# EAGLE design NorthPaw_V1p5 (EAGLE 5.05)
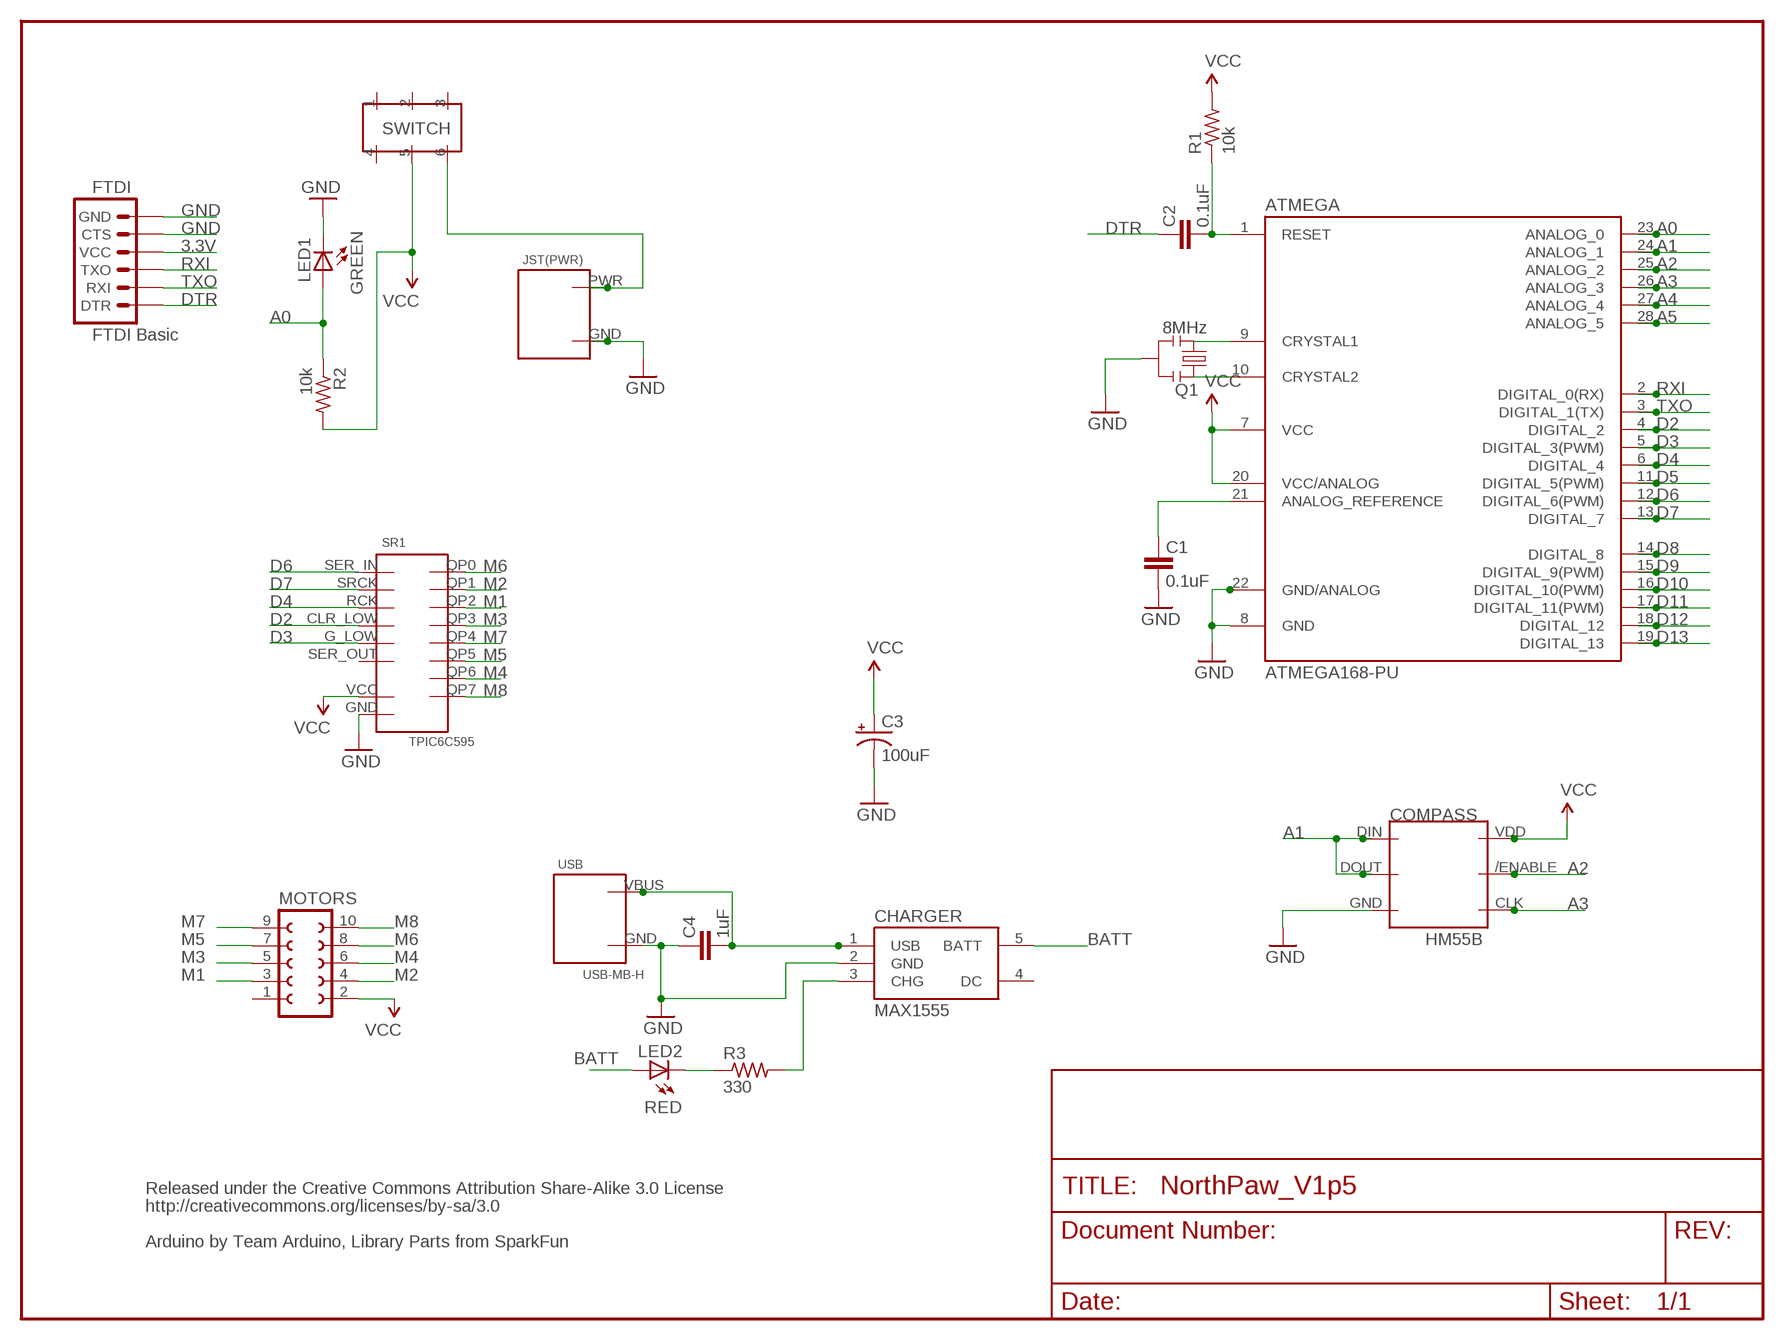
[diagram p0: schematic, sheet 1]

## Parts
ATMEGA  ATMEGA168-PU  [DIL28-3]
C1  0.1uF  CAPPTH  [CAP-PTH-SMALL]
C2  0.1uF  CAPPTH  [CAP-PTH-SMALL]
C3  100uF  CAP_POLPTH1  [CPOL-RADIAL-100UF-25V]
C4  1uF  CAPPTH  [CAP-PTH-SMALL]
CHARGER  MAX1555  [SOT23-5]
COMPASS  HM55B  [HM55B]
FTDI  FTDI Basic  ARDUINO_SERIAL_PROGRAMPTH  [1X06]
JST(PWR)  S2B-PH-K-S  [S4B-ZR]
LED1  GREEN  LED3MM  [LED3MM]
LED2  RED  LED3MM  [LED3MM]
MOTORS  FE05-2  [FE05-2]
Q1  8MHz  RESONATORPTH  [RESONATOR-PTH]
R1  10k  R-US_0204/7  [0204/7]
R2  10k  R-US_0204/7  [0204/7]
R3  330  R-US_0204/7  [0204/7]
SR1  TPIC6C595  [TPIC6C595]
SWITCH  OS202011MA0QS1  [OS202011MA0QS1]
USB  USB-MB-H  [USB-MB-H]

## Nets
3.3V [ground]: ATMEGA.7(VCC) ATMEGA.20(VCC/ANALOG) C3.1(+) COMPASS.VDD FTDI.4(VCC) MOTORS.2 R1.2 R2.2 SR1.VCC SWITCH.5 ; supply symbol labelled VCC
A0: ATMEGA.23(ANALOG_0) LED1.A R2.1
A1: ATMEGA.24(ANALOG_1) COMPASS.DIN(IN) COMPASS.DOUT(OUT)
A2: ATMEGA.25(ANALOG_2) COMPASS./ENABLE(ENABLE)
A3: ATMEGA.26(ANALOG_3) COMPASS.CLK
A4: ATMEGA.27(ANALOG_4)
A5: ATMEGA.28(ANALOG_5)
BATT [power]: CHARGER.5(BATT) JST(PWR).PWR LED2.A SWITCH.6
D2: ATMEGA.4(DIGITAL_2) SR1.CLR_LOW
D3: ATMEGA.5(DIGITAL_3(PWM)) SR1.G_LOW
D4: ATMEGA.6(DIGITAL_4) SR1.RCK
D5: ATMEGA.11(DIGITAL_5(PWM))
D6: ATMEGA.12(DIGITAL_6(PWM)) SR1.SER_IN
D7: ATMEGA.13(DIGITAL_7) SR1.SRCK
D8: ATMEGA.14(DIGITAL_8)
D9: ATMEGA.15(DIGITAL_9(PWM))
D10: ATMEGA.16(DIGITAL_10(PWM))
D11: ATMEGA.17(DIGITAL_11(PWM))
D12: ATMEGA.18(DIGITAL_12)
D13: ATMEGA.19(DIGITAL_13)
DTR: C2.2 FTDI.1(DTR)
GND [ground]: ATMEGA.8(GND) ATMEGA.22(GND/ANALOG) C1.1 C3.2(-) C4.2 CHARGER.2(GND) FTDI.5(CTS) FTDI.6(GND) JST(PWR).GND LED1.K(C) Q1.2 SR1.GND USB.GND
M1: MOTORS.3 SR1.QP2
M2: MOTORS.4 SR1.QP1
M3: MOTORS.5 SR1.QP3
M4: MOTORS.6 SR1.QP6
M5: MOTORS.7 SR1.QP5
M6: MOTORS.8 SR1.QP0
M7: MOTORS.9 SR1.QP4
M8: MOTORS.10 SR1.QP7
N$1: ATMEGA.9(CRYSTAL1) Q1.3
N$2: ATMEGA.10(CRYSTAL2) Q1.1
N$3: ATMEGA.21(ANALOG_REFERENCE) C1.2
N$7: CHARGER.3(CHG) R3.2
N$9: LED2.K(C) R3.1
RESET: ATMEGA.1(RESET) C2.1 R1.1
RXI: ATMEGA.2(DIGITAL_0(RX)) FTDI.3(TXO)
TXO: ATMEGA.3(DIGITAL_1(TX)) FTDI.2(RXI)
USB_VIN: C4.1 CHARGER.1(USB) USB.VBUS(PWR)
Unconnected: CHARGER.4(DC) MOTORS.1 SR1.SER_OUT

## Notes on the sheet
- SWITCH
- Released under the Creative Commons Attribution Share-Alike 3.0 License
- http://creativecommons.org/licenses/by-sa/3.0
- Arduino by Team Arduino, Library Parts from SparkFun

## Power pins joined to a net without a drawn wire
1: SWITCH.1
2: SWITCH.2
3: SWITCH.3
4: SWITCH.4
GND: COMPASS.GND

## Library data of the parts
ATMEGA = Arduino-AVR:ATMEGA168-PU
C1 C2 C4 = SparkFun:CAP: Capacitor Standard 0603 ceramic capacitor, and 0.1" leaded capacitor.
C3 = SparkFun:CAP_POL: Capacitor Polarized These are standard SMD and PTH capacitors. Normally 10uF, 47uF, and 100uF in electrolytic and tantalum varieties. Always verify the external diameter of the through hole cap, it varies with capacity, voltage, and manufacturer. The EIA devices should be standard.
CHARGER = SparkFun:MAX1555: MAX1555 Lithium Charger IC SOT-23 Lithium Polymer charging IC. Schematic element and footprint proven. Spark Fun Electronics SKU : COM-00674
COMPASS = North_Paw:HM55B
FTDI = SparkFun:ARDUINO_SERIAL_PROGRAM
JST(PWR) = North_Paw:S2B-PH-K-S
LED1 LED2 = SparkFun:LED: LEDs Standard schematic elements and footprints for 5mm, 3mm, 1206, and 0603 sized LEDs. 5mm - Spark Fun Electronics SKU : COM-00529 (and others)
MOTORS = North_Paw:FE05-2: FEMALE HEADER
Q1 = SparkFun:RESONATOR: Resonator Small SMD resonator. This is the itty bitty 10/20MHz resonators with built in caps. CSTCE10M0G55 and CSTCE20M0V53. Footprint has been reviewed closely but hasn't been tested yet.
R1-R3 = resistor:R-US_: RESISTOR, American symbol
SR1 = North_Paw:TPIC6C595
SWITCH = OS202011MA0QS1:OS202011MA0QS1
USB = North_Paw:USB-MB-H

## Net classes
0 default: width 0.381 mm, clearance 0.381 mm
1 power: width 0.508 mm, clearance 0.381 mm
2 ground: width 0.508 mm, clearance 0.381 mm

## Board
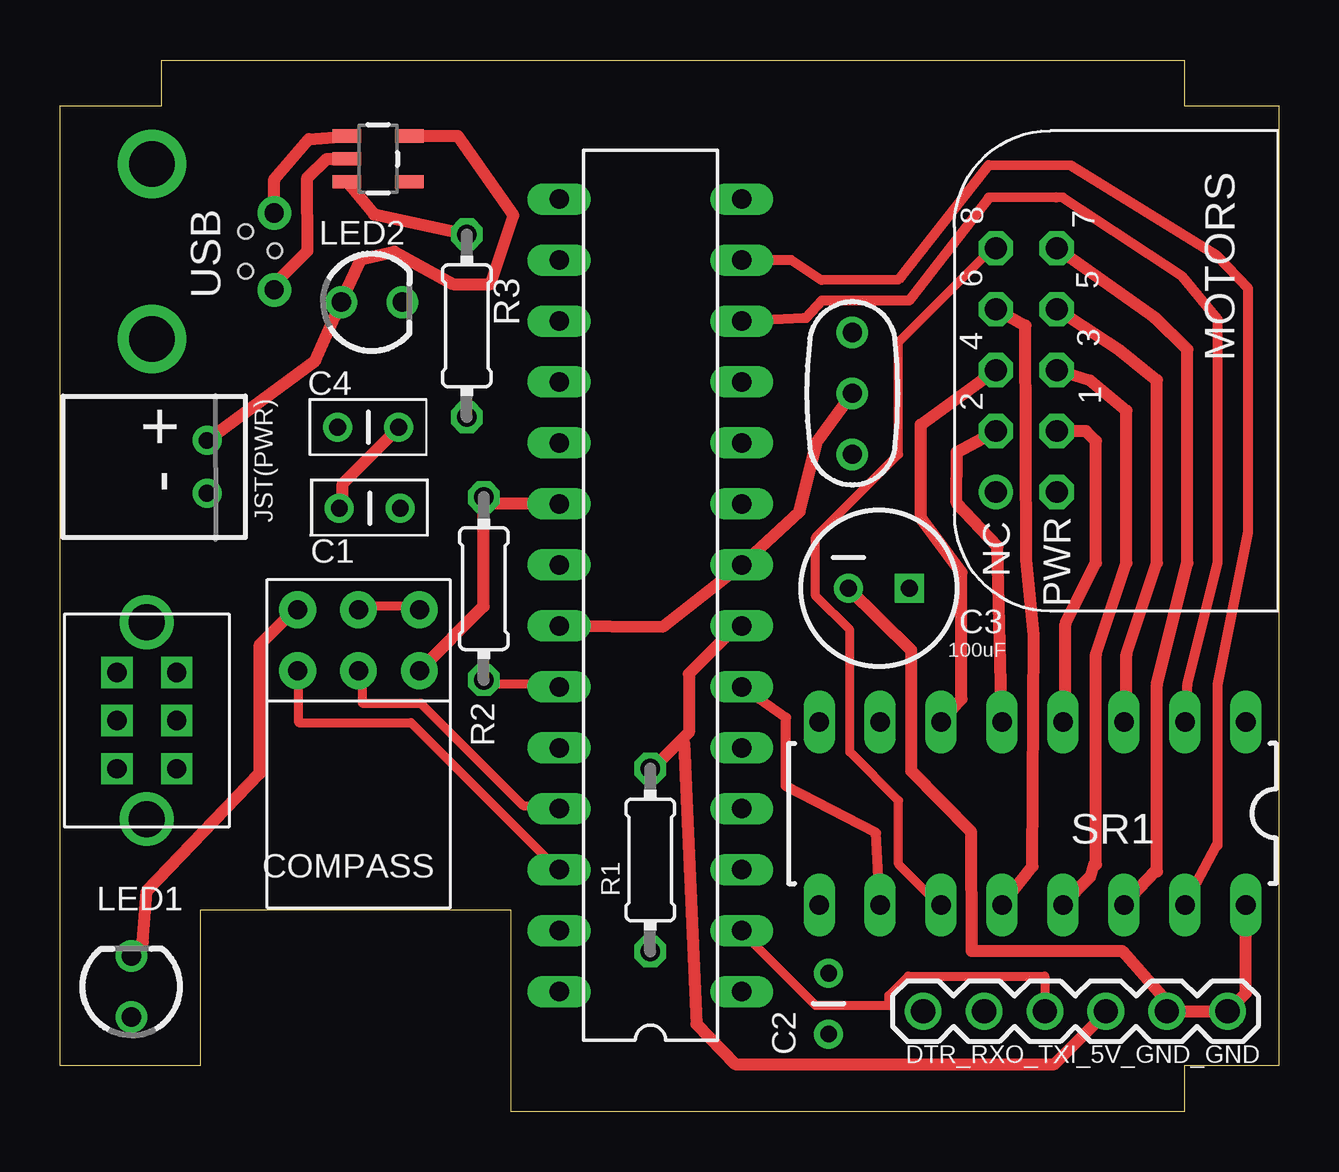
[diagram p1: board, top side]
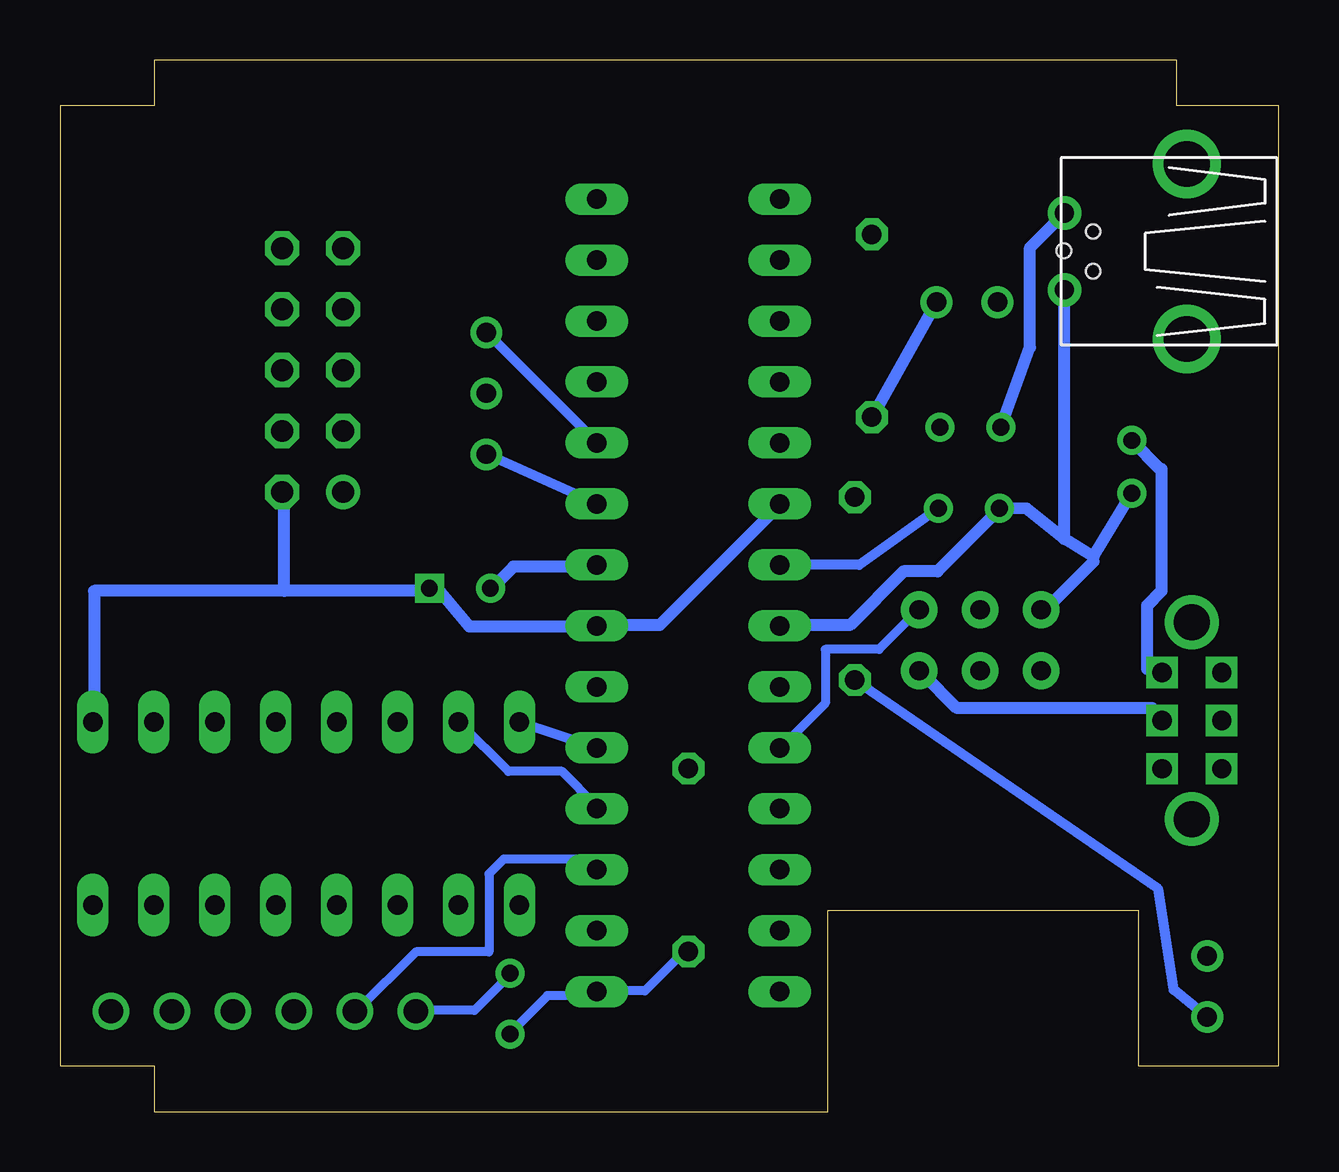
[diagram p2: board, bottom side, seen from below]

Size 50.8 x 43.81 mm. Coordinates in mm from the lower left corner, seen from the top.
Outline: 0,1.9 0,41.91 4.24,41.91 4.24,43.81 46.86,43.81 46.86,41.91 50.8,41.91 50.8,1.9 46.86,1.9 46.86,0 18.8,0 18.8,8.38 5.84,8.38 5.84,1.9 0,1.9
Copper layers (1*16): Top 0.035mm / dielectric 1.5mm / Bottom 0.035mm
Design rules "default *": minimum track width 8mil, minimum drill 24mil, track to track 8mil, track to pad 6mil, pad to pad 6mil, via to via 6mil, smd to smd 6mil, copper to edge 40mil, drill to drill 8mil, minimum pad ring 10mil, minimum via ring 8mil, stop-mask expansion 4mil, vias tented up to drill 0mil, thermal gap 10mil

### Footprints (pad centres in the part's own frame; a part is rotated, then mirrored left to right if it is on the bottom)
DIL28-3 = drill 0.813 long: 1 -16.51,-3.81; 2 -13.97,-3.81; 3 -11.43,-3.81; 4 -8.89,-3.81; 5 -6.35,-3.81; 6 -3.81,-3.81; 7 -1.27,-3.81; 8 1.27,-3.81; 9 3.81,-3.81; 10 6.35,-3.81; 11 8.89,-3.81; 12 11.43,-3.81; 13 13.97,-3.81; 14 16.51,-3.81; 15 16.51,3.81; 16 13.97,3.81; 17 11.43,3.81; 18 8.89,3.81; 19 6.35,3.81; 20 3.81,3.81; 21 1.27,3.81; 22 -1.27,3.81; 23 -3.81,3.81; 24 -6.35,3.81; 25 -8.89,3.81; 26 -11.43,3.81; 27 -13.97,3.81; 28 -16.51,3.81
CAP-PTH-SMALL = drill 0.7 round: 1 0,0; 2 2.54,0
CPOL-RADIAL-100UF-25V = drill 0.7 square: 1 1.27,0 | drill 0.7 round: 2 -1.27,0
SOT23-5 = smd 0.55 x 1.2: 1 -0.95,-1.3; 2 0,-1.3; 3 0.95,-1.3; 4 0.95,1.3; 5 -0.95,1.3
HM55B = drill 0.8 pad 1.524 round: /ENABLE 0,0; CLK 2.54,0; DIN -2.54,-2.54; DOUT 0,-2.54; GND 2.54,-2.54; VDD -2.54,0
1X06 = drill 1.016 round: 1 0,0; 2 2.54,0; 3 5.08,0; 4 7.62,0; 5 10.16,0; 6 12.7,0
S4B-ZR = drill 0.7 pad 1.15 round: GND 1.1,0; PWR -1.1,0
LED3MM = drill 0.813 round: A -1.27,0; K 1.27,0
FE05-2 = drill 0.914 round: 1 5.05,-6.27 | drill 0.914 octagon: 2 5.05,-3.73; 3 2.51,-6.27; 4 2.51,-3.73; 5 -0.03,-6.27; 6 -0.03,-3.73; 7 -2.57,-6.27; 8 -2.57,-3.73; 9 -5.11,-6.27; 10 -5.11,-3.73
RESONATOR-PTH = drill 0.8 round: 1 -2.54,0; 2 0,0; 3 2.54,0
0204/7 = drill 0.813 octagon: 1 -3.81,0; 2 3.81,0
TPIC6C595 = drill 0.813 long: CLR_LOW -3.81,-6.35; G_LOW -3.81,-8.89; GND 3.81,8.89; QP0 -3.81,3.81; QP1 -3.81,1.27; QP2 -3.81,-1.27; QP3 -3.81,-3.81; QP4 3.81,-3.81; QP5 3.81,-1.27; QP6 3.81,1.27; QP7 3.81,3.81; RCK 3.81,-6.35; SER_IN -3.81,6.35; SER_OUT 3.81,-8.89; SRCK 3.81,6.35; VCC -3.81,8.89
OS202011MA0QS1 = drill 0.8 pad 1.016 square: 1 -2.007,1.245; 2 0,1.245; 3 2.007,1.245; 4 -2.007,-1.245; 5 0,-1.245; 6 2.007,-1.245 | drill 1.499 pad 2.032 round: P$1 4.102,0; P$2 -4.102,0
USB-MB-H = drill 0.8 pad 1.397 round: GND 5.1,-1.6; VBUS 5.1,1.6 | drill 1.9 round: P$6 0,-3.65; P$7 0,3.65 | hole 0.6: 3.911,0.829; 5.13,0.023; 3.911,-0.829

### Placement (x,y rotation side)
ATMEGA  24.61,21.51 90 top
C1  11.64,25.13 0 top
C2  32.04,3.23 90 top
C3  34.13,21.81 0 top
C4  11.58,28.51 0 top
CHARGER  13.26,39.7 270 top
COMPASS  12.45,18.37 180 top
FTDI  35.97,4.18 0 top
JST(PWR)  6.13,26.86 270 top
LED1  2.98,5.21 90 top
LED2  13,33.72 0 top
MOTORS  45.27,30.87 270 top
Q1  33.03,29.93 270 top
R1  24.6,10.48 90 top
R2  17.67,21.79 90 top
R3  16.96,32.74 90 top
SR1  40.54,12.42 270 top
SWITCH  3.62,16.29 90 top
USB  3.83,35.84 0 top

### Tracks (layer width: path | path; a pad name or v marks a point on that pad's centre or on a via)
3.3V
  Top 0.508: 25.91,15.49 26.21,15.8 26.21,18.24 28.25,20.27 ATMEGA.7 | 25.91,15.49 24.79,14.38 R1.2 | FTDI.4 43.48,4.01 41.45,1.98 28.14,1.98 26.53,3.64 26.01,15.39 25.91,15.49 | COMPASS.VDD 17.67,21.05 R2.2 17.68,25.35 20.73,25.35 ATMEGA.20
  Bottom 0.508: SWITCH.5 4.88,16.41 5.28,16.82 13.41,16.82 14.83,18.24 COMPASS.VDD | ATMEGA.20 20.93,25.15 25.81,20.27 28.25,20.27 ATMEGA.7 28.65,20.27 28.85,20.2 33.73,20.2 35.15,21.89 C3.1 | C3.1 35.56,21.89 | 41.45,21.69 35.56,21.69 C3.1 | 41.45,21.69 49.38,21.69 49.38,16.41 SR1.VCC | MOTORS.2 41.45,25.76 41.45,21.69
A0
  Top 0.381: ATMEGA.23 20.73,17.83 17.68,17.83 R2.1
  Bottom 0.406: LED1.A 4.37,5.07 5.02,9.28 R2.1
A1
  Top 0.381: COMPASS.DOUT 12.6,21.08 14.83,21.08 COMPASS.DIN
  Bottom 0.381: ATMEGA.24 20.73,15.19 18.9,17.02 18.9,19.25 16.66,19.25 15.04,20.88 COMPASS.DIN
A2
  Top 0.381: ATMEGA.25 20.73,12.75 19.3,12.75 15.04,17.02 12.6,17.02 12.6,18.24 COMPASS./ENABLE
A3
  Top 0.381: ATMEGA.26 20.73,10.11 14.63,16.21 9.96,16.21 9.96,18.24 COMPASS.CLK
BATT
  Top 0.508: CHARGER.5 16.59,40.65 18.91,37.34 17.95,34.47 16.38,34.47 13.94,35.83 12.56,35.51 LED2.A 10.64,31.29 JST(PWR).PWR
  Bottom 0.508: SWITCH.6 4.88,18.44 5.49,18.44 5.49,21.08 4.88,21.69 4.88,26.77 4.93,26.77 JST(PWR).PWR
D2
  Bottom 0.381: ATMEGA.4 28.45,12.75 29.87,14.17 32.11,14.17 34.14,16.21 SR1.CLR_LOW
D3
  Bottom 0.406: ATMEGA.5 SR1.G_LOW
D4
  Top 0.406: SR1.RCK 34.02,11.61 30.26,13.56 30.26,16.42 ATMEGA.6
D6
  Top 0.406: SR1.SER_IN 46.99,16.23 46.99,17.78 48.26,22.86 48.26,33.02 46.77,34.8 41.8,38.08 41.51,38.09 38.72,38.08 35.39,33.79 31.75,33.79 31.1,33.06 31,33.06 ATMEGA.12
D7
  Top 0.406: SR1.SRCK 48.19,11.08 48.26,11.08 48.26,17.78 49.53,24.13 49.53,34.29 48.21,35.67 42.14,39.41 38.7,39.44 34.94,34.66 31.74,34.64 30.48,35.48 ATMEGA.13
DTR
  Bottom 0.381: C2.2 32.11,5.64 33.53,4.22 35.97,4.22 FTDI.1
GND
  Top 0.508: CHARGER.2 11.12,39.7 10.31,38.92 10.31,35.86 8.93,34.48 USB.GND | Q1.2 31.55,27.9 30.83,25 ATMEGA.8 25.13,20.21 ATMEGA.22 20.52,20.27 | 14.22,28.6 C4.2 14.02,28.4 11.79,26.16 11.79,25.15 C1.1 | LED1.K 3.05,6.65 3.45,7.06 3.62,9.18 8.33,14.09 8.33,19.46 9.75,20.88 COMPASS.GND | C3.2 35.48,19.24 35.48,14.19 37.98,11.65 38,6.69 44.27,6.69 46.41,4.29 | 46.41,4.29 46.51,4.18 FTDI.6 49.43,4.93 SR1.GND | FTDI.5 46.33,4.22 46.41,4.29
  Bottom 0.508: 8.94,23.87 10.5,25.13 C1.1 11.79,24.94 14.22,22.5 15.65,22.5 17.88,20.27 20.73,20.27 ATMEGA.22 | 7.72,23.11 8.94,23.87 | 7.72,23.11 7.72,22.91 9.55,21.08 9.75,21.08 COMPASS.GND | C3.2 32.72,21.89 31.9,22.71 28.45,22.71 ATMEGA.8 | 8.94,23.87 8.94,34.23 USB.GND | 7.72,23.11 JST(PWR).GND
M1
  Top 0.508: SR1.QP2 39.08,23.55 37.37,25.38 37.38,27.48 MOTORS.3
M2
  Top 0.406: SR1.QP1 41.91,16.33
  Top 0.508: MOTORS.4 42.76,28.36 43.18,27.94 43.18,22.86 41.91,20.32 41.91,16.33
  Bottom 0.381: SR1.QP1 41.66,16.41
M3
  Top 0.508: SR1.QP3 37.58,17.19 37.58,22.46 35.88,24.74 35.88,28.62 MOTORS.5
M4
  Top 0.508: SR1.QP6 42.94,9.78 43.11,10.3 43.18,10.3 43.18,19.05 44.45,22.86 44.45,29.21 42.94,30.46 MOTORS.6
M5
  Top 0.508: SR1.QP5 40.54,10.21 40.59,19.85 40.28,22.98 40.25,32.74 MOTORS.7
M6
  Top 0.508: SR1.QP0 44.45,16.23 44.45,19.05 45.72,22.86 45.72,30.48 44.19,31.71 MOTORS.8
M7
  Top 0.381: SR1.QP4 36.58,8.69 34.95,10.31 34.95,12.95 32.92,14.99 32.92,20.07 31.5,21.49 31.5,23.93 34.95,27.38 34.95,32.05 38.81,35.92 MOTORS.9
M8
  Top 0.508: SR1.QP7 45.65,10 45.72,10 45.72,17.78 46.99,22.86 46.99,31.75 45.61,33.09 MOTORS.10
N$1
  Bottom 0.406: ATMEGA.9 Q1.3
N$2
  Bottom 0.406: ATMEGA.10 Q1.1
N$3
  Bottom 0.406: C1.2 17.48,22.78 ATMEGA.21
N$7
  Top 0.508: R3.2 13.09,37.38 CHARGER.3
N$9
  Bottom 0.508: R3.1 LED2.K
RESET
  Bottom 0.381: C2.1 31.9,3.4 30.48,4.83 28.45,4.83 ATMEGA.1 28.25,5.03 26.42,5.03 24.79,6.65 R1.1
RXI
  Top 0.381: ATMEGA.2 28.45,7.47 31.5,4.42 34.54,4.42 34.54,4.83 35.36,5.64 41.05,5.64 41.05,4.22 FTDI.3
  Bottom 0.381: ATMEGA.2 28.45,7.47
TXO
  Bottom 0.381: ATMEGA.3 28.45,10.11 28.85,10.52 32.31,10.52 32.92,9.91 32.92,6.65 35.97,6.65 38.41,4.22 FTDI.2
USB_VIN
  Top 0.508: CHARGER.1 10.37,40.52 8.95,38.86 8.93,38.86 USB.VBUS
  Bottom 0.508: C4.1 10.37,31.84 10.37,36 USB.VBUS

### Text on the board
tPlace: DTR_RXO_TXI_5V_GND_GND
tValues: RES 8Mhz | <-Off On-> | reverse